# EAGLE board AniBike_v2.8_BT_MainBoard (EAGLE 5.08), part 1 of 2
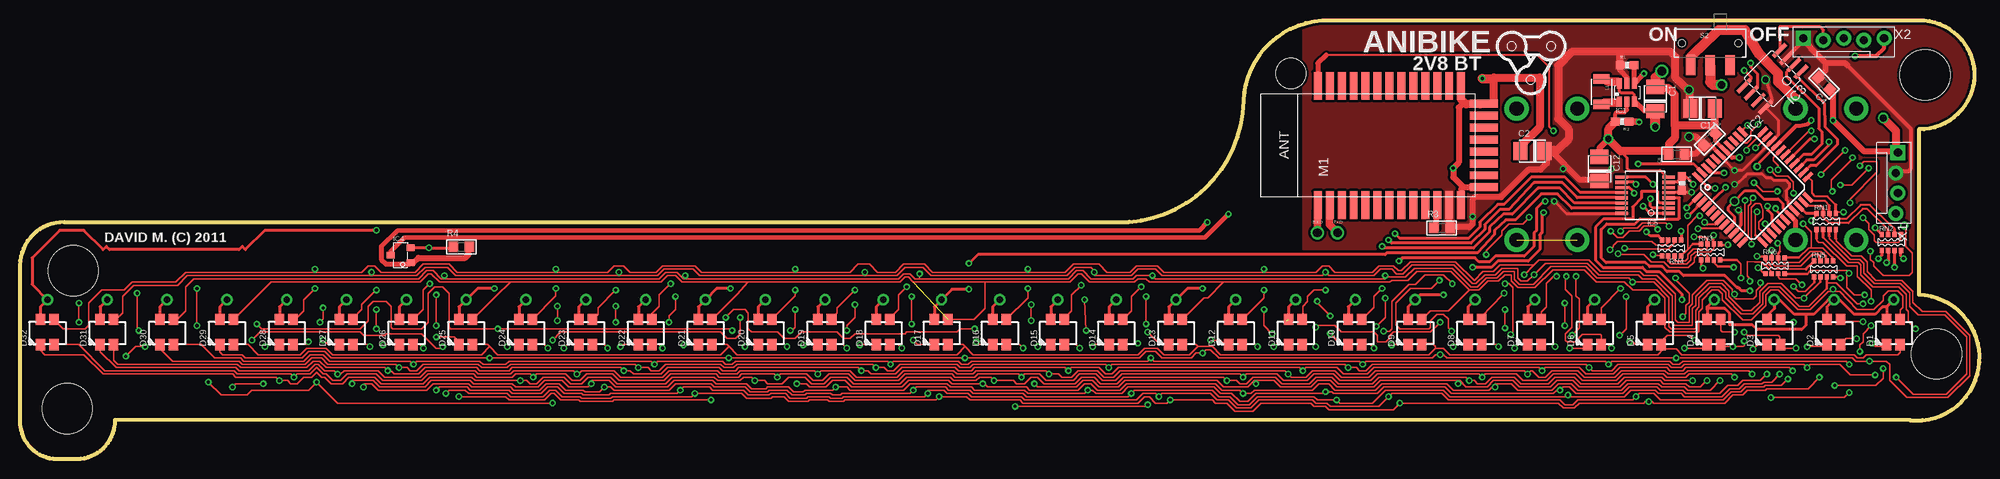
[diagram p5: board, top side]
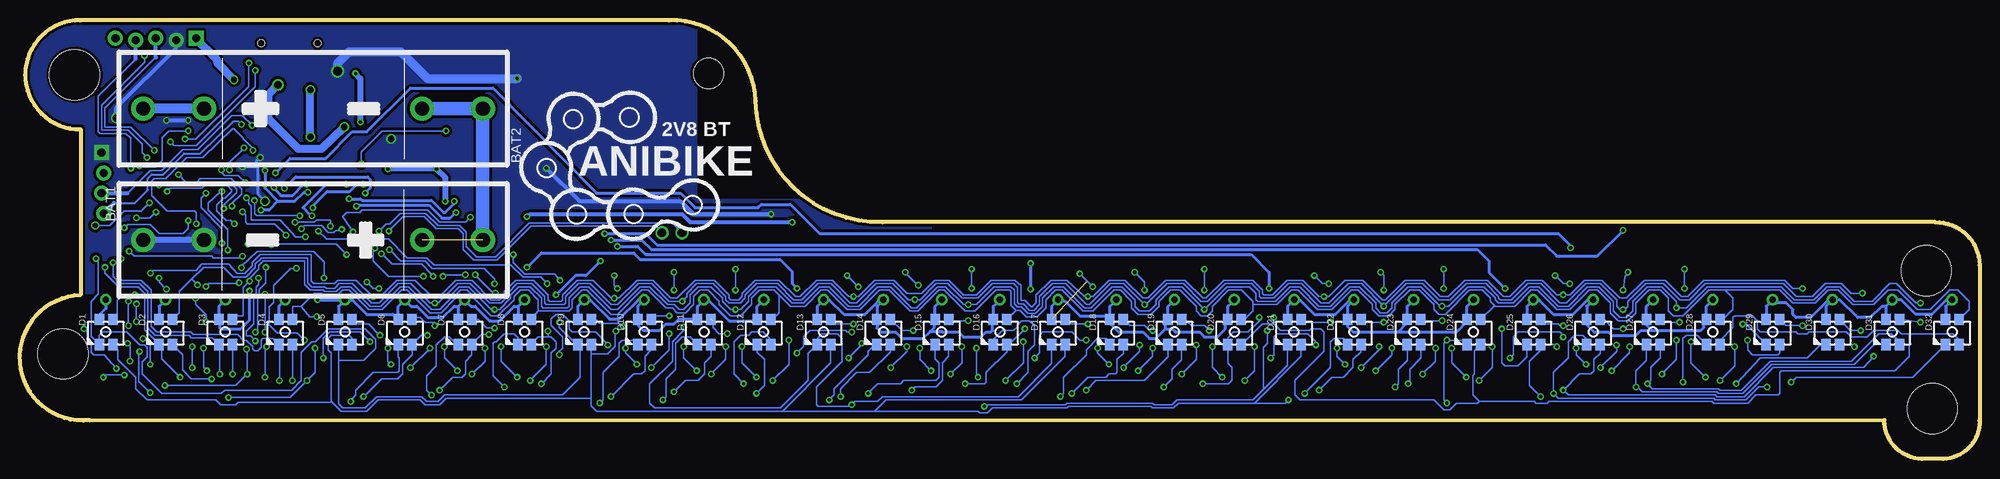
[diagram p6: board, bottom side, seen from below]

Size 246.3 x 55.17 mm. Coordinates in mm from the lower left corner, seen from the top.
Outline: 137.87,29.77 arc90 153.82,45.01 arc-90 164.69,55.17 238.66,55.17 arc-182 238.66,41.45 238.66,20.62 arc-184 237.54,4.88 11.96,4.91 arc-90 7.26,0 4.57,0 arc-90 0,4.83 0,24.38 arc-90 5.59,29.77 137.87,29.77
Copper layers (1*16): Top 0.035mm / dielectric 1.5mm / Bottom 0.035mm
Design rules "default *": minimum track width 7mil, minimum drill 15mil, track to track 7mil, track to pad 8mil, pad to pad 8mil, via to via 8mil, smd to smd 8mil, copper to edge 10mil, drill to drill 15mil, minimum pad ring 10mil, minimum via ring 8mil, stop-mask expansion 4mil, vias tented up to drill 32mil, thermal gap 10mil
Holes 6.35 mm at 240.89,13.21 239.42,48.31 6.71,23.67 5.94,6.35
Holes 3.81 mm at 159.74,48.49

## Footprints (pad centres in the part's own frame; a part is rotated, then mirrored left to right if it is on the bottom)
BATTERY_AAA = drill 1.778 pad 3.048 round: MINUS1 21.336,0; MINUS2 13.716,0; PLUS1 -21.336,0; PLUS2 -13.716,0
C3528-21/T = smd 1.778 x 2.286: + 1.524,0; - -1.524,0
C0805 = smd 1.2 x 1.3: 1 -1.016,0; 2 1.016,0
LED1210_DS_ISO = drill 0.8 pad 1.422 round: 1 0,4.064 | smd 1.2 x 1.4 bottom: BOT1 0.813,-1.575; BOT2 -0.889,-1.575; BOT3 -0.889,1.575; BOT4 0.813,1.575 | smd 1.2 x 1.4: TOP1 -0.889,-1.575; TOP2 0.813,-1.575; TOP3 0.813,1.575; TOP4 -0.889,1.575
DDC = smd 0.635 x 1.27: 1 -0.95,-1.15; 2 0,-1.15; 3 0.95,-1.15; 4 0.95,1.15; 5 0,1.15; 6 -0.95,1.15
TQFP44 = smd 1.5 x 0.5: 1 -5.8,4; 2 -5.8,3.2; 3 -5.8,2.4; 4 -5.8,1.6; 5 -5.8,0.8; 6 -5.8,0; 7 -5.8,-0.8; 8 -5.8,-1.6; 9 -5.8,-2.4; 10 -5.8,-3.2; 11 -5.8,-4; 23 5.8,-4; 24 5.8,-3.2; 25 5.8,-2.4; 26 5.8,-1.6; 27 5.8,-0.8; 28 5.8,0; 29 5.8,0.8; 30 5.8,1.6; 31 5.8,2.4; 32 5.8,3.2; 33 5.8,4 | smd 0.5 x 1.5: 12 -4,-5.8; 13 -3.2,-5.8; 14 -2.4,-5.8; 15 -1.6,-5.8; 16 -0.8,-5.8; 17 0,-5.8; 18 0.8,-5.8; 19 1.6,-5.8; 20 2.4,-5.8; 21 3.2,-5.8; 22 4,-5.8; 34 4,5.8; 35 3.2,5.8; 36 2.4,5.8; 37 1.6,5.8; 38 0.8,5.8; 39 0,5.8; 40 -0.8,5.8; 41 -1.6,5.8; 42 -2.4,5.8; 43 -3.2,5.8; 44 -4,5.8
SOIC8 = smd 0.5 x 2.2: 1 -1.905,-3.154; 2 -0.645,-3.154; 3 0.625,-3.154; 4 1.895,-3.154; 5 1.905,3.154; 6 0.635,3.154; 7 -0.635,3.154; 8 -1.905,3.154
HALL_SENSOR_SE = smd 1 x 0.8: 1 1.15,-1; 2 1.15,0.9; 3 -1.35,-0.05
TSSOP16 = smd 0.4 x 1.6: 1 -2.225,-2.85; 2 -1.575,-2.85; 3 -0.925,-2.85; 4 -0.275,-2.85; 5 0.375,-2.85; 6 1.025,-2.85; 7 1.675,-2.85; 8 2.325,-2.85; 9 2.325,3.05; 10 1.675,3.05; 11 1.025,3.05; 12 0.375,3.05; 13 -0.275,3.05; 14 -0.925,3.05; 15 -1.575,3.05; 16 -2.225,3.05
1210 = smd 1.2 x 2: 1 -1.6,0; 2 1.6,0
BTM400_6B = smd 3.5 x 1: 1 -7.4,7.66; 2 -7.4,6.16; 3 -7.4,4.66; 4 -7.4,3.16; 5 -7.4,1.66; 6 -7.4,0.16; 7 -7.4,-1.34; 8 -7.4,-2.84; 9 -7.4,-4.34; 10 -7.4,-5.84; 11 -7.4,-7.34; 12 -7.4,-8.84; 13 -7.4,-10.34; 22 7.6,-10.34; 23 7.6,-8.84; 24 7.6,-7.34; 25 7.6,-5.84; 26 7.6,-4.34; 27 7.6,-2.84; 28 7.6,-1.34; 29 7.6,0.16; 30 7.6,1.66; 31 7.6,3.16; 32 7.6,4.66; 33 7.6,6.16; 34 7.6,7.66 | smd 1 x 3.5: 14 -5.15,-13.2; 15 -3.65,-13.2; 16 -2.15,-13.2; 17 -0.65,-13.2; 18 0.85,-13.2; 19 2.35,-13.2; 20 3.85,-13.2; 21 5.35,-13.2
0603-RES = smd 1.1 x 1: 1 -0.85,0; 2 0.85,0
R0805 = smd 1.2 x 1.3: 1 -1.016,0; 2 1.016,0
YCTC164 = smd 0.559 x 0.6: P$1 -1.2,-1.003; P$2 -0.4,-1.003; P$3 0.4,-1.003; P$4 1.2,-1.003; P$5 1.2,1.003; P$6 0.4,1.003; P$7 -0.4,1.003; P$8 -1.2,1.003
SWITCH-SPDT-SMD = smd 1.2 x 2.5: 1 -2.5,-2.75; 2 0,-2.75; 3 2.5,-2.75 | hole 0.9: -3.55,0; 3.55,0
MOLEX-1X4_LOCK = drill 1.016 pad 1.88 square: 1 0,0.127 | drill 1.016 pad 1.88 round: 2 2.54,-0.127; 3 5.08,0.127; 4 7.62,-0.127
MOLEX-1X5_LOCK = drill 1.016 pad 1.88 square: 1 0,0.127 | drill 1.016 pad 1.88 round: 2 2.54,-0.127; 3 5.08,0.127; 4 7.62,-0.127; 5 10.16,0.127

## Placement (x,y rotation side)
BAT1  BATTERY_AAA  [BATTERY_AAA]  209.45,27.53 180 bottom
BAT2  BATTERY_AAA  [BATTERY_AAA]  209.45,44.04 0 bottom
C1  10uF  [C3528-21/T]  205.54,45.26 270 top
C2  10uF  [C3528-21/T]  190.09,38.71 0 top
C3  100nF  [C0805]  212.39,40.18 225 top
C4  100nF  [C0805]  226.75,47.22 135 top
C6  100nF  [C0805]  208.23,38.3 0 top
C11  47uF  [C3528-21/T]  211.48,44.09 180 top
C12  10uF  [C3528-21/T]  198.53,36.47 270 top
D1  LED_RGB_DS_ISO  [LED1210_DS_ISO]  235.51,15.95 0 top
D2  LED_RGB_DS_ISO  [LED1210_DS_ISO]  227.99,15.95 0 top
D3  LED_RGB_DS_ISO  [LED1210_DS_ISO]  220.47,15.95 0 top
D4  LED_RGB_DS_ISO  [LED1210_DS_ISO]  212.95,15.95 0 top
D5  LED_RGB_DS_ISO  [LED1210_DS_ISO]  205.44,15.95 0 top
D6  LED_RGB_DS_ISO  [LED1210_DS_ISO]  197.92,15.95 0 top
D7  LED_RGB_DS_ISO  [LED1210_DS_ISO]  190.4,15.95 0 top
D8  LED_RGB_DS_ISO  [LED1210_DS_ISO]  182.88,15.95 0 top
D9  LED_RGB_DS_ISO  [LED1210_DS_ISO]  175.36,15.95 0 top
D10  LED_RGB_DS_ISO  [LED1210_DS_ISO]  167.84,15.95 0 top
D11  LED_RGB_DS_ISO  [LED1210_DS_ISO]  160.32,15.95 0 top
D12  LED_RGB_DS_ISO  [LED1210_DS_ISO]  152.81,15.95 0 top
D13  LED_RGB_DS_ISO  [LED1210_DS_ISO]  145.29,15.95 0 top
D14  LED_RGB_DS_ISO  [LED1210_DS_ISO]  137.77,15.95 0 top
D15  LED_RGB_DS_ISO  [LED1210_DS_ISO]  130.45,15.95 0 top
D16  LED_RGB_DS_ISO  [LED1210_DS_ISO]  123.14,15.95 0 top
D17  LED_RGB_DS_ISO  [LED1210_DS_ISO]  115.82,15.95 0 top
D18  LED_RGB_DS_ISO  [LED1210_DS_ISO]  108.51,15.95 0 top
D19  LED_RGB_DS_ISO  [LED1210_DS_ISO]  101.19,15.95 0 top
D20  LED_RGB_DS_ISO  [LED1210_DS_ISO]  93.68,15.95 0 top
D21  LED_RGB_DS_ISO  [LED1210_DS_ISO]  86.16,15.95 0 top
D22  LED_RGB_DS_ISO  [LED1210_DS_ISO]  78.64,15.95 0 top
D23  LED_RGB_DS_ISO  [LED1210_DS_ISO]  71.12,15.95 0 top
D24  LED_RGB_DS_ISO  [LED1210_DS_ISO]  63.6,15.95 0 top
D25  LED_RGB_DS_ISO  [LED1210_DS_ISO]  56.08,15.95 0 top
D26  LED_RGB_DS_ISO  [LED1210_DS_ISO]  48.56,15.95 0 top
D27  LED_RGB_DS_ISO  [LED1210_DS_ISO]  41.05,15.95 0 top
D28  LED_RGB_DS_ISO  [LED1210_DS_ISO]  33.53,15.95 0 top
D29  LED_RGB_DS_ISO  [LED1210_DS_ISO]  26.01,15.95 0 top
D30  LED_RGB_DS_ISO  [LED1210_DS_ISO]  18.49,15.95 0 top
D31  LED_RGB_DS_ISO  [LED1210_DS_ISO]  10.97,15.95 0 top
D32  LED_RGB_DS_ISO  [LED1210_DS_ISO]  3.45,15.95 0 top
IC1  TI_TPS61073DDC  [DDC]  201.98,46.08 0 top
IC2  ATXMEGA_XX_D4TQFP44  [TQFP44]  217.78,34.19 45 top
IC3  AT26DF321  [SOIC8]  220.27,47.8 135 top
IC4  HALL_SENSORSMT  [HALL_SENSOR_SE]  47.96,25.65 0 top
IC5  SN74CB3Q3251TSSOP16  [TSSOP16]  204.37,33.12 90 top
L1  4.7 uH  [1210]  198.78,46.18 270 top
M1  BTM400_6BBTM400_6B  [BTM400_6B]  170.79,39.32 90 top
R1  [0603-RES]  201.98,49.53 0 top
R2  [0603-RES]  201.37,42.42 180 top
R3  10K  [R0805]  178.71,29.06 0 top
R4  10K  [R0805]  55.47,26.67 0 top
R5  47k  [0603-RES]  208.89,34.67 270 top
RN1  RESISTOR_ARR4  [YCTC164]  227.03,29.87 0 top
RN2  RESISTOR_ARR4  [YCTC164]  235.2,27.23 0 top
RN3  RESISTOR_ARR4  [YCTC164]  212.5,26.01 0 top
RN4  RESISTOR_ARR4  [YCTC164]  207.57,26.52 180 top
RN5  RESISTOR_ARR4  [YCTC164]  226.69,23.88 0 top
RN6  RESISTOR_ARR4  [YCTC164]  220.57,24.28 0 top
S2  [SWITCH-SPDT-SMD]  212.45,52.27 0 top
U$1  ANIBIKE_LOGOLOGO_3_MED  [ANIBIKE_LOGO_3_MEDIUM]  189.89,50.5 0 top
U$2  ANIBIKE_LOGOLOGO_6_BIG  [ANIBIKE_LOGO_6_BIG]  168.55,37.49 0 bottom
X1  PDI_INTERFACEHEADER0.1IN  [MOLEX-1X4_LOCK]  235.92,38.51 270 top
X2  ANIBIKE_SEC_INTERFACEHEADER0.1IN  [MOLEX-1X5_LOCK]  224.13,52.81 0 top

## Tracks (layer width: path | path; a pad name or v marks a point on that pad's centre or on a via)
+3.6V  (via drill 0.41, 0.7, 0.8)
  Top 0.203: 222.98,31.22 IC2.19 | 201.13,49.65 R1.1 | 179.63,31.41 M1.12
  Top 0.406: 222.98,31.22 222.2,32 222.2,32.41 222,32.61 222,33.73 222.4,34.14 222.4,34.65 222,35.05 220.37,35.05 220.07,35.36 219.46,35.36 218.95,35.86 217.12,35.86 216.71,35.46 215.85,34.65 215.75,34.54 v215.49,34.54 | v219.41,47.7 220.22,45.06 219.84,44.68 IC3.8 220.98,42.63 220.98,40.74 220.23,39.99 IC2.31 216.47,36.27 v215.49,36.27 214.38,37.39 214.38,37.59 IC2.39 | C12.+ v200.05,36.47 | v192.84,32.41 194.36,30.89 201.31,30.89 IC5.16 | 208.88,33.52 R5.2 | 208.88,33.52 208.89,33.53 207.25,33.53 IC5.5 | 208.88,33.52 209.27,33.53 v210.11,33.53 | v216,31.29 216.31,30.99 216.31,29.36 216.04,29.06 IC2.9
  Top 0.508: C3.2 212.5,39.46 IC2.39 | IC3.3 224.36,52.93 X2.1 | 229.72,49.48 237.64,41.55 237.64,36.47 237.34,36.17 235.99,36.17 X1.2
  Top 0.559: 45.42,26.72 47.45,28.75 148.23,28.75 v149.25,29.77
  Top 0.61: 45.42,26.72 45.42,25.1 46.02,24.49 48.94,24.49 IC4.1
  Top 0.635: R1.1 201.07,49.58 201.07,48.88 201.98,47.97 IC1.5
  Top 0.762: C3.2 210.57,38.35 209.25,38.35 209.19,38.3 C6.2 | R3.2 179.63,29.06 179.53,29.16 179.63,29.16 | 179.63,29.16 182.17,29.16 182.58,29.57 v182.58,30.48 182.58,32.61 182.88,32.92 186.13,32.92 189.59,36.37 191.11,36.37 191.92,37.19 191.92,38.81 | 179.63,29.16 179.63,31.41 | IC4.1 49.44,24.65 50.09,25.3 55.98,25.3 56.39,25.7 56.39,26.57 R4.2 | C12.+ 198.22,35.15 195.99,35.15 192.33,38.81 | 229.72,49.48 229.36,49.83 226.92,49.83 | 226.92,49.83 225.2,51.56 X2.1 | C4.2 226.92,48.83 226.92,49.83
  Top 0.889: C3.2 210.62,40.52 v209.8,40.49
  Top 0.914: 201.07,51.21 201.07,49.99 201.13,49.65
  Top 1.016: C2.+ 191.92,38.81 192.33,38.81 193.24,38.81 194.67,40.23 194.67,41.45 193.34,42.77 193.34,49.48 195.07,51.21 201.07,51.21 207.47,51.21 208.08,50.55 208.08,47.9 209.6,46.43 v209.8,46.43 209.8,44.3 210.01,44.15 C11.+
  Bottom 0.406: 224.28,52.93 X2.1 | v210.11,33.53 210.62,33.53 211.73,32.41 213.87,32.41 | 213.87,32.41 215.49,34.04 v215.49,34.54 v215.49,36.27 | 213.87,32.41 214.99,31.29 v216,31.29
  Bottom 0.508: v182.58,30.48 182.17,30.78 163.07,30.78 162.05,29.77 v149.25,29.77 | v200.05,36.47 v193.95,36.47
  Bottom 0.762: v193.95,36.47 192.84,35.36 v192.84,32.41
  Bottom 1.016: v209.8,40.49 v209.8,46.43 | v219.41,47.7 221.39,49.68 221.59,50.29 224.28,52.93
  pour Top (isolate 0.305, no thermals): 185.62,58.22 246.18,58.22 249.43,54.97 249.43,26.11 249.02,25.7 186.03,25.7 161.24,26.31 161.24,57.61
B1_BOT  (via drill 0.41)
  Top 0.203: v201.88,20.42 201.88,16.36 v201.07,15.54 | v171.6,20.22 171.6,17.78 v170.48,16.66 | v141.53,20.42 v141.53,16.97 | v112.06,20.42 v112.06,16.97 | v82.4,20.42 82.4,18.8 81.58,17.98 v81.58,17.17 | v52.32,20.62 v52.32,16.76 | v22.25,21.44 v22.25,16.76 | v231.85,20.62 230.53,20.62 229.62,21.54 229.62,22.99 v229.9,23.37 229.58,23.69 225.15,23.67 225.04,23.67 224.64,23.27 | 221.79,23.27 RN6.P$4
  Top 0.305: 224.64,23.27 221.79,23.27
  Bottom 0.203: v229.9,23.37 229.57,23.7 224.18,23.7 224.16,23.72 223.42,24.49 220.07,24.49 219,23.32 218.03,23.32 217.12,24.28 217.12,24.71 216.13,25.7 209.7,25.7 209.7,22.35 209.4,22.05 206.76,22.05 206.35,22.45 204.01,22.45 201.98,20.42 v201.88,20.42 200.96,20.42 198.93,22.45 196.6,22.45 194.56,20.42 193.55,20.42 191.52,22.45 189.48,22.45 187.05,20.02 186.03,20.02 185.42,20.62 185.42,21.03 184,22.45 181.76,22.45 179.93,20.62 179.93,20.02 179.73,19.81 178.31,19.81 178.1,20.02 178.1,20.62 176.28,22.45 174.24,22.45 172.01,20.22 v171.6,20.22 170.99,20.22 168.76,22.45 166.73,22.45 164.49,20.22 163.68,20.22 161.44,22.45 159,22.45 157.18,20.62 157.18,20.22 156.97,20.02 155.96,20.02 155.55,20.42 155.55,20.83 153.92,22.45 150.88,22.45 148.84,20.42 148.23,20.42 146.2,22.45 144.17,22.45 142.14,20.42 v141.53,20.42 140.92,20.42 138.89,22.45 136.45,22.45 134.82,20.83 132.99,20.83 131.37,22.45 129.54,22.45 127.71,20.62 126.09,20.62 124.26,22.45 121.21,22.45 120.5,21.84 120.5,19.91 119.99,19.91 119.18,19.1 119.08,19.1 118.57,19.61 118.57,20.62 116.74,22.45 114.71,22.45 112.47,20.42 v112.06,20.42 111.46,20.42 109.42,22.45 107.39,22.45 105.16,20.22 104.55,20.22 102.31,22.45 99.87,22.45 97.64,20.22 97.23,20.22 95,22.45 91.34,22.45 90.12,21.23 90.12,20.83 89.92,20.62 88.9,20.62 87.07,22.45 85.04,22.45 83.01,20.42 v82.4,20.42 81.79,20.42 79.76,22.45 77.52,22.45 75.08,20.02 74.68,20.02 72.24,22.45 69.8,22.45 67.77,20.42 66.75,20.42 64.72,22.45 61.87,22.45 59.84,20.42 59.03,20.42 57,22.45 54.97,22.45 53.14,20.62 v52.32,20.62 51.51,20.62 49.68,22.45 47.45,22.45 45.21,20.22 44.4,20.22 42.16,22.45 39.52,22.45 37.49,20.42 36.68,20.42 34.65,22.45 24.49,22.45 23.47,21.44 v22.25,21.44
  Bottom 0.203: v201.07,15.54 202.49,16.97 203.99,16.97 D5.BOT3 | v170.48,16.66 170.99,17.07 173.43,17.07 174.04,17.68 174.24,17.68 174.12,17.48 D9.BOT3 | v141.53,16.97 143.84,16.97 D13.BOT3 | v112.06,16.97 114.38,16.97 D17.BOT3 | v81.58,17.17 84.91,17.17 D21.BOT3 | v52.32,16.76 52.73,16.76 52.93,16.97 54.64,16.97 D25.BOT3 | v22.25,16.76 24.36,16.76 D29.BOT3 | v231.85,20.62 233.38,20.62 234.09,19.91 234.09,18.06 D1.BOT3
B1_TOP  (via drill 0.41)  (1 unrouted)
  Top 0.203: D1.TOP3 236.32,18.75 236.63,19.05 236.63,20.52 236.02,21.13 234.8,21.13 234.19,20.52 234.19,19.91 232.97,18.8 230.84,18.8 228.7,21.03 227.89,21.03 | 227.89,21.03 227.28,21.03 225.04,18.8 223.42,18.8 220.98,21.23 220.07,21.23 219.46,20.62 219.46,19.3 217.63,17.48 216.51,17.48 213.97,20.02 213.97,20.73 213.46,21.23 212.65,21.23 211.43,20.02 211.43,18.9 211.02,18.49 211.02,15.95 207.37,15.95 206.76,16.56 206.76,17.37 | 91.54,22.25 110.64,22.25 111.25,22.86 111.66,22.86 112.27,22.25 131.98,22.25 132.99,23.27 133.4,23.27 134.42,22.25 140.11,22.25 140.51,22.66 141.53,22.66 141.94,22.25 151.28,22.25 | 91.54,22.25 83.21,22.25 82.4,23.06 81.38,23.06 80.57,22.25 61.67,22.25 | 61.67,22.25 52.73,22.25 51.71,23.27 51.31,23.27 50.29,22.25 31.6,22.25 26.87,17.53 D29.TOP3 | D13.TOP3 148.84,20.27 149.3,20.27 151.28,22.25 | 121.41,22.25 121.31,22.25 121.31,18.9 119.94,17.53 D17.TOP3 | D21.TOP3 90.12,20.68 91.54,22.25 | D25.TOP3 59.84,20.47 61.67,22.25 | D9.TOP3 177.24,18.59 179.53,18.59 182.17,21.23 | 206.76,17.37 206.4,17.37 D5.TOP3 | 206.76,17.37 206.76,20.22 205.74,21.23 202.69,21.23 201.68,22.25 198.12,22.25 196.6,23.77 192.63,23.77 190.4,21.54 188.26,21.54 187.45,22.35 187.45,23.16 186.64,23.16 185.83,22.35 184.51,22.35 183.39,21.23 182.17,21.23 | 182.17,21.23 179.83,23.57 175.56,23.57 174.45,22.45 172.42,22.45 172.21,22.25 151.28,22.25 | v228.8,22.76 228.69,22.87 | 227.89,21.03 v227.89,21.34
  Top 0.305: 228.69,22.87 RN5.P$4
  Bottom 0.203: v228.8,22.76 228.8,22.25 v227.89,21.34
B2_BOT  (via drill 0.41)
  Top 0.203: v194.16,19.61 v194.16,16.76 | v163.07,19.81 163.07,19.61 v164.69,17.98 | v133.81,20.02 v134.01,16.15 | v104.95,19.41 104.95,17.78 103.94,16.76 v103.94,16.15 | v74.88,19.2 v74.88,17.17 | v44.81,18.8 v44.81,16.36 | v14.73,20.83 14.73,16.36 v14.94,16.15 | RN6.P$3 220.97,22.87 221.18,22.66 223.22,22.66 v223.98,21.89
  Bottom 0.203: D2.BOT3 227.08,17.58 226.26,18.39 226.26,21.03 224.69,22.61 | 224.69,22.61 223.22,24.08 220.68,24.08 219.51,22.91 217.88,22.91 216.71,24.08 216.71,24.51 215.93,25.3 210.11,25.3 210.11,22.15 209.6,21.64 207.98,21.64 207.77,21.44 206.76,21.44 206.15,22.05 204.52,22.05 202.08,19.61 201.17,19.61 198.73,22.05 197.21,22.05 194.77,19.61 v194.16,19.61 193.75,19.61 191.31,22.05 189.69,22.05 187.25,19.61 185.83,19.61 185.01,20.42 185.01,20.83 183.79,22.05 181.97,22.05 180.34,20.42 180.34,19.61 180.14,19.41 177.9,19.41 177.7,19.61 177.7,20.42 176.07,22.05 174.65,22.05 172.01,19.41 171.2,19.41 168.55,22.05 166.93,22.05 164.69,19.81 v163.07,19.81 162.46,20.42 162.46,20.83 161.24,22.05 159.21,22.05 157.58,20.42 157.58,20.02 157.18,19.61 155.75,19.61 155.14,20.22 155.14,20.62 153.72,22.05 151.08,22.05 149.05,20.02 148.03,20.02 146,22.05 144.37,22.05 141.94,19.61 141.12,19.61 138.68,22.05 136.65,22.05 134.62,20.02 v133.81,20.02 133.2,20.02 131.17,22.05 129.74,22.05 127.91,20.22 125.88,20.22 124.05,22.05 121.41,22.05 120.9,21.54 120.9,19.71 120.7,19.51 120.19,19.51 119.38,18.69 118.87,18.69 118.16,19.41 118.16,20.42 116.54,22.05 114.91,22.05 112.27,19.41 111.86,19.41 109.22,22.05 107.59,22.05 v104.95,19.41 104.75,19.41 102.11,22.05 100.08,22.05 97.84,19.81 97.03,19.81 94.79,22.05 91.54,22.05 90.53,21.03 90.53,20.42 90.32,20.22 88.7,20.22 86.87,22.05 85.24,22.05 82.8,19.61 81.79,19.61 79.35,22.05 77.72,22.05 v74.88,19.2 74.68,19.2 74.68,19.41 72.03,22.05 70,22.05 67.97,20.02 66.55,20.02 64.52,22.05 62.08,22.05 60.45,20.42 60.45,20.22 60.25,20.02 58.83,20.02 56.79,22.05 55.17,22.05 52.73,19.61 51.92,19.61 49.48,22.05 47.65,22.05 45.62,20.02 45.62,19.2 45.21,18.8 v44.81,18.8 44.6,18.8 44.2,19.2 44.2,19.81 41.96,22.05 39.73,22.05 37.69,20.02 36.47,20.02 34.44,22.05 24.69,22.05 23.06,20.42 21.03,20.42 19.41,22.05 17.37,22.05 16.15,20.83 v14.73,20.83
  Bottom 0.203: v164.69,17.98 166.52,17.98 D10.BOT3 | v134.01,16.15 135.41,16.15 D14.BOT3 | v103.94,16.15 104.34,16.15 104.95,16.76 106.78,16.76 106.98,16.97 D18.BOT3 | v74.88,17.17 76.91,17.17 77.32,17.37 D22.BOT3 | v44.81,16.36 46.02,16.36 47.24,17.58 D26.BOT3 | v14.94,16.15 16.23,16.15 D30.BOT3 | D6.BOT3 196.77,17.78 195.99,17.78 195.38,17.17 194.16,17.17 v194.16,16.76 | 224.69,22.61 v223.98,21.89
B2_TOP  (via drill 0.41)
  Top 0.203: D2.TOP3 229.06,17.27 v231.65,17.27 | v231.65,19.51 230.94,19.51 228.3,22.15 227.08,22.15 227.1,22.13 | 227.08,21.44 224.84,19.2 223.62,19.2 221.18,21.64 219.86,21.64 219.05,20.83 219.05,19.51 217.78,18.24 216.36,18.24 214.38,20.22 214.38,20.93 213.66,21.64 212.45,21.64 211.02,20.22 211.02,19.1 210.62,18.69 210.62,16.36 207.57,16.36 207.26,16.66 207.26,20.32 205.33,22.25 v202.69,22.25 202.18,22.76 198.22,22.76 196.8,24.18 192.43,24.18 190.2,21.95 188.47,21.95 187.86,22.56 187.86,23.57 186.44,23.57 185.62,22.76 184.3,22.76 183.18,21.64 182.37,21.64 180.04,23.98 175.26,23.98 174.14,22.86 171.81,22.86 v171.6,23.06 171.6,22.66 142.75,22.66 v142.34,23.06 140.31,23.06 139.9,22.66 134.62,22.66 133.6,23.67 132.79,23.67 131.78,22.66 113.08,22.66 | v201.17,21.44 198.73,19 D6.TOP3 | 113.08,22.66 112.47,22.66 111.86,23.27 111.05,23.27 110.44,22.66 83.62,22.66 | 83.62,22.66 83.41,22.66 82.6,23.47 81.18,23.47 80.37,22.66 53.34,22.66 | 53.34,22.66 52.93,22.66 51.92,23.67 51.1,23.67 50.09,22.66 21.84,22.66 20.83,21.64 20.83,18.59 19.76,17.53 D30.TOP3 | D10.TOP3 170.18,19.05 170.18,20.42 v171.2,21.44 | v140.92,21.64 139.7,20.42 139.7,18.59 138.63,17.53 D14.TOP3 | 113.08,22.66 v113.08,23.27 | v111.46,21.64 110.44,20.62 110.44,18.8 109.32,17.68 D18.TOP3 | 83.62,22.66 v83.62,23.06 | v81.79,22.05 80.37,20.62 80.37,19.2 79.45,18.29 D22.TOP3 | 53.34,22.66 v53.34,23.06 | v51.51,22.05 50.7,21.23 50.7,18.8 49.43,17.53 D26.TOP3
  Top 0.305: 227.08,22.15 227.08,21.44 | RN5.P$3 227.1,22.13
  Bottom 0.203: v231.65,19.51 v231.65,17.27 | v202.69,22.25 201.88,21.44 v201.17,21.44 | v171.2,21.44 171.6,21.84 v171.6,23.06 | v142.34,23.06 v140.92,21.64 | v113.08,23.27 v111.46,21.64 | v83.62,23.06 82.6,22.05 v81.79,22.05 | v53.34,23.06 52.32,22.05 v51.51,22.05
B3_BOT  (via drill 0.41)  (1 unrouted)
  Top 0.178: RN6.P$2 220.17,23.46 220.07,23.57 220.07,23.65 219.41,24.31 219.33,24.31 218.85,24.79 218.01,24.79
  Top 0.203: v186.64,18.8 v186.64,16.46 | v156.36,18.8 156.36,16.76 v157.38,15.75 | v127.1,19.41 v127.1,17.37 | v97.43,18.8 97.43,16.56 97.03,16.15 v96.82,16.15 | v67.56,19.2 v67.56,17.37 | v38.1,19 38.1,17.58 v37.69,17.17 | v7.42,19.61 v7.42,17.17 | 218.01,24.79 217.12,24.82 217.12,23.01 217.42,22.71 v217.42,22.35
  Bottom 0.203: D3.BOT3 219.15,17.98 218.24,17.98 218.24,21.51 | v186.64,16.46 187.66,16.46 188.72,17.53 D7.BOT3 | v127.1,17.37 129.13,17.37 129.18,17.53 D15.BOT3 | v96.82,16.15 97.43,16.76 99.06,16.76 99.92,17.53 D19.BOT3 | v67.56,17.37 69.77,17.37 D23.BOT3 | v37.69,17.17 39.7,17.17 D27.BOT3 | v7.42,19.61 8.03,19.61 10.46,22.05 11.28,22.05 13.51,19.81 15.75,19.81 17.58,21.64 19.2,21.64 20.83,20.02 23.27,20.02 24.89,21.64 34.24,21.64 36.88,19 v38.1,19 38.1,19.81 39.93,21.64 41.76,21.64 43.59,19.81 43.59,18.59 44.4,17.78 45.21,17.78 46.02,18.59 46.02,19.81 47.85,21.64 49.28,21.64 51.71,19.2 52.93,19.2 55.37,21.64 56.59,21.64 58.62,19.61 60.45,19.61 60.86,20.02 60.86,20.22 62.28,21.64 64.31,21.64 66.75,19.2 v67.56,19.2 67.77,19.2 70.21,21.64 71.83,21.64 73.86,19.61 73.86,19 74.47,18.39 75.29,18.39 75.9,19 75.9,19.61 77.93,21.64 79.15,21.64 81.58,19.2 83.01,19.2 85.45,21.64 86.66,21.64 88.49,19.81 90.73,19.81 90.93,20.02 90.93,20.83 91.74,21.64 94.59,21.64 v97.43,18.8 100.28,21.64 101.9,21.64 103.53,20.02 103.53,19.41 104.34,18.59 105.56,18.59 106.17,19.2 106.17,20.02 107.8,21.64 109.02,21.64 111.66,19 112.47,19 115.11,21.64 116.33,21.64 117.75,20.22 117.75,19.2 118.67,18.29 119.58,18.29 120.4,19.1 120.9,19.1 121.31,19.51 121.31,21.23 121.72,21.64 123.85,21.64 126.09,19.41 v127.1,19.41 127.71,19.41 129.95,21.64 130.96,21.64 133.6,19 134.21,19 136.86,21.64 138.48,21.64 140.92,19.2 142.14,19.2 144.58,21.64 145.8,21.64 147.83,19.61 149.25,19.61 151.28,21.64 153.52,21.64 154.74,20.42 154.74,19.81 155.75,18.8 v156.36,18.8 156.97,18.8 157.99,19.81 157.99,20.22 159.41,21.64 161.04,21.64 162.05,20.62 162.05,19.61 162.86,18.8 163.47,18.8 164.08,19.41 164.9,19.41 167.13,21.64 168.35,21.64 171.2,18.8 172.01,18.8 174.85,21.64 175.87,21.64 177.29,20.22 177.29,19.2 177.5,19 180.54,19 180.75,19.2 180.75,20.22 182.17,21.64 183.59,21.64 184.61,20.62 184.61,20.22 186.03,18.8 v186.64,18.8 187.05,18.8 189.89,21.64 191.11,21.64 191.92,20.83 191.92,20.42 193.55,18.8 194.56,18.8 197.41,21.64 198.53,21.64 200.96,19.2 202.29,19.2 204.72,21.64 205.94,21.64 206.55,21.03 207.98,21.03 208.18,21.23 209.8,21.23 210.52,21.95 210.52,24.89 215.72,24.89 216.26,24.36 216.26,23.88 217.42,22.71 v217.42,22.35 218.24,21.54 218.24,21.51
  Bottom 0.203: v7.42,17.17 10.03,17.58 D31.BOT3 | 159.05,17.53 159.21,17.37 159.21,16.56 158.39,15.75 v157.38,15.75 | 218.24,21.51 218.21,21.54
B3_TOP  (via drill 0.41)
  Top 0.203: D3.TOP3 221.64,17.17 v222.91,17.17 | v193.14,22.96 192.74,22.96 191.82,22.05 191.82,19.1 191.21,18.49 D7.TOP3 | 106.17,23.06 110.24,23.06 111.25,24.08 113.49,24.08 114.5,23.06 131.57,23.06 132.59,24.08 134.62,24.08 135.03,23.67 v135.03,23.47 135.03,23.06 139.7,23.06 140.51,23.88 142.75,23.88 143.56,23.06 163.68,23.06 v164.08,23.47 164.49,23.06 170.18,23.06 170.99,23.88 172.42,23.88 173.02,23.27 173.84,23.27 174.96,24.38 180.24,24.38 182.58,22.05 182.98,22.05 184.1,23.16 185.42,23.16 186.23,23.98 188.26,23.98 188.26,22.76 188.67,22.35 189.48,22.35 v190.3,23.16 191.72,24.59 197,24.59 198.42,23.16 203.4,23.16 203.91,22.66 205.54,22.66 207.67,20.52 207.67,17.07 207.98,16.76 210.21,16.76 210.21,18.9 210.62,19.3 210.62,20.42 212.24,22.05 213.87,22.05 214.78,21.13 214.78,20.42 216.51,18.69 217.63,18.69 218.64,19.71 218.64,21.03 219.66,22.05 221.39,22.05 223.22,20.22 v224.23,20.22 226.3,22.28 | 106.17,23.06 85.45,23.06 84.63,23.88 80.98,23.88 80.16,23.06 75.29,23.06 | 75.29,23.06 54.76,23.06 53.75,24.08 50.9,24.08 49.89,23.06 44.2,23.06 | 44.2,23.06 21.03,23.06 19.81,21.84 14.33,21.84 12.9,20.42 12.9,18.39 12.04,17.53 D31.TOP3 | v164.08,21.23 162.66,21.23 161.85,20.42 161.85,19.81 161.24,19.2 161.24,17.98 161.14,17.88 D11.TOP3 | v133.4,21.84 132.18,20.62 132.18,18.59 131.27,17.68 D15.TOP3 | 106.17,23.06 v106.17,23.47 | v104.95,21.23 102.72,19 102.72,18.39 102.01,17.68 D19.TOP3 | 75.29,23.06 v75.29,23.47 | v74.88,21.23 72.64,19 72.64,18.19 71.93,17.48 D23.TOP3 | 44.2,23.06 v44.2,23.47 | v44.81,21.23 42.98,19.41 42.98,18.8 41.86,17.68 D27.TOP3
  Top 0.305: RN5.P$2 226.3,22.28
  Bottom 0.203: v222.91,17.17 222.91,18.08 224.23,19.41 v224.23,20.22 | v190.3,23.16 192.94,23.16 v193.14,22.96 | v164.08,23.47 v164.08,21.23 | v135.03,23.47 v133.4,21.84 | v106.17,23.47 104.95,22.25 v104.95,21.23 | v75.29,23.47 74.88,23.06 v74.88,21.23 | v44.2,23.47 44.6,22.86 v44.81,21.23
B4_BOT  (via drill 0.41)
  Top 0.203: RN6.P$1 219.24,23.28 | v208.08,22.76 208.08,22.56 209.8,20.83 209.8,19.71 209.4,19.3 209.4,18.29 v208.99,17.88
  Top 0.305: 219.24,23.28 v218.47,24.05
  Bottom 0.203: D4.BOT3 212.04,17.58 212.04,19.2 210.92,19.2 | 181.15,18.59 181.99,17.55 D8.BOT3 | 181.15,18.59 181.15,20.02 182.37,21.23 183.39,21.23 184.2,20.42 184.2,20.02 186.23,17.98 187.05,17.98 189.28,20.22 189.28,20.42 190.09,21.23 190.91,21.23 191.52,20.62 191.52,20.22 193.34,18.39 194.77,18.39 197.61,21.23 198.32,21.23 200.76,18.8 202.49,18.8 204.93,21.23 205.74,21.23 206.35,20.62 208.18,20.62 208.38,20.83 209.3,20.83 210.92,19.2 | 181.15,18.59 177.29,18.59 176.89,19 176.89,20.02 175.67,21.23 175.06,21.23 172.01,18.19 171.2,18.19 168.15,21.23 167.34,21.23 165.1,19 164.29,19 163.68,18.39 162.66,18.39 161.65,19.41 161.65,20.42 160.83,21.23 159.82,21.23 158.39,19.81 158.39,19.41 156.97,17.98 155.75,17.98 154.33,19.41 154.33,20.22 153.31,21.23 151.49,21.23 150.88,20.62 | 150.88,20.62 150.88,18.39 151.74,17.53 D12.BOT3 | 150.88,20.62 149.45,19.2 147.62,19.2 145.59,21.23 144.78,21.23 142.34,18.8 140.72,18.8 138.28,21.23 137.06,21.23 134.42,18.59 133.4,18.59 130.76,21.23 130.15,21.23 127.51,18.59 126.29,18.59 123.65,21.23 121.92,21.23 121.72,21.03 121.72,19.33 121.08,18.69 | 122.25,17.55 D16.BOT3 121.08,18.69 | D20.BOT3 92.41,17.53 91.34,18.59 91.34,19.41 | 91.34,19.41 88.29,19.41 86.46,21.23 85.65,21.23 83.21,18.8 81.38,18.8 78.94,21.23 78.13,21.23 76.3,19.41 76.3,18.8 75.49,17.98 74.27,17.98 73.46,18.8 73.46,19.41 71.63,21.23 70.41,21.23 68.58,19.41 68.58,18.8 67.97,18.19 67.16,18.19 64.11,21.23 62.48,21.23 61.47,20.22 61.47,19.81 60.86,19.2 | 62.53,17.53 D24.BOT3 61.04,19.2 60.86,19.2 | 60.86,19.2 58.42,19.2 56.39,21.23 55.58,21.23 53.14,18.8 51.51,18.8 49.07,21.23 48.06,21.23 46.43,19.61 46.43,18.39 45.42,17.37 44.2,17.37 43.18,18.39 43.18,19.61 41.55,21.23 40.13,21.23 39.12,20.22 39.12,18.59 38.51,17.98 37.29,17.98 34.04,21.23 32,21.23
  Bottom 0.203: 32,21.23 30.99,20.22 30.99,18.8 32.26,17.53 D28.BOT3 | 32,21.23 25.1,21.23 23.47,19.61 20.62,19.61 19,21.23 17.78,21.23 15.95,19.41 13.31,19.41 11.48,21.23 10.26,21.23 7.82,18.8 6.2,18.8 3.76,21.23 2.74,21.23 1.32,19.81 1.32,18.8 2.57,17.55 D32.BOT3 | 91.34,19.41 91.34,19.81 92.76,21.23 94.39,21.23 96.42,19.2 96.42,18.59 97.03,17.98 97.84,17.98 98.45,18.59 98.45,19.2 100.48,21.23 101.7,21.23 103.12,19.81 103.12,19.2 104.14,18.19 105.77,18.19 106.58,19 106.58,19.81 108,21.23 108.81,21.23 111.46,18.59 112.67,18.59 115.32,21.23 116.13,21.23 117.35,20.02 117.35,19 118.47,17.88 119.79,17.88 120.6,18.69 121.08,18.69 | v208.08,22.76 208.08,24.79 209.4,26.11 216.48,26.11 218.47,24.23 v218.47,24.05 | v208.99,17.88 209.91,17.88 210.92,19.2
B4_TOP  (via drill 0.41)
  Top 0.203: v215.49,15.95 213.97,15.95 213.77,16.15 D4.TOP3 | 190.3,24.38 190.91,24.99 197.21,24.99 198.63,23.57 203.61,23.57 204.11,23.06 205.74,23.06 208.08,20.73 208.08,17.48 208.38,17.17 209.8,17.17 209.8,19.1 210.21,19.51 210.21,20.62 212.04,22.45 214.07,22.45 215.19,21.34 215.19,21.03 v215.49,20.73 215.49,20.32 215.7,20.12 217.83,20.12 218.24,20.52 218.24,21.18 218.74,21.69 v218.74,22.15 | v186.54,20.83 186.33,20.62 183.69,17.88 D8.TOP3 | 190.3,24.38 v189.08,23.16 | 190.3,24.38 186.03,24.38 185.22,23.57 183.9,23.57 182.78,22.45 180.44,24.79 174.75,24.79 173.63,23.67 173.23,23.67 172.62,24.28 170.79,24.28 169.98,23.47 165.3,23.47 164.49,24.28 163.68,24.28 162.86,23.47 156.36,23.47 | 156.36,23.47 143.76,23.47 142.95,24.28 140.31,24.28 139.5,23.47 136.65,23.47 135.64,24.49 132.38,24.49 131.37,23.47 126.7,23.47 | 126.7,23.47 114.71,23.47 113.69,24.49 111.05,24.49 110.03,23.47 107.8,23.47 106.78,24.49 105.36,24.49 104.34,23.47 97.43,23.47 | 97.43,23.47 85.65,23.47 84.84,24.28 80.77,24.28 79.96,23.47 76.71,23.47 75.9,24.28 74.68,24.28 73.86,23.47 67.36,23.47 | 67.36,23.47 54.97,23.47 53.95,24.49 50.7,24.49 49.68,23.47 45.42,23.47 44.6,24.28 43.79,24.28 42.98,23.47 37.08,23.47 | 37.08,23.47 20.83,23.47 19.61,22.25 14.12,22.25 13.11,21.23 10.26,21.23 8.64,19.61 8.64,16.76 8.23,16.36 5.44,16.36 D32.TOP3 | 37.08,23.47 v37.08,23.88 | v37.08,21.44 35.66,20.02 35.66,18.59 34.59,17.53 D28.TOP3 | D24.TOP3 67.36,20.47 v67.36,21.44 | 67.36,23.47 v67.36,23.88 | D20.TOP3 97.43,20.47 v97.43,21.23 | 97.43,23.47 v97.43,23.88 | D16.TOP3 126.7,20.27 v126.7,21.44
  Top 0.203: 126.7,23.47 v126.7,23.88 | D12.TOP3 156.36,20.27 v156.36,21.23 | 156.36,23.47 v156.36,23.88 | RN5.P$1 225.38,22.86 225.35,22.86 | v222.91,21.69 223.52,21.08 224.38,21.08 225.5,22.19
  Top 0.305: RN5.P$1 225.5,22.19
  Bottom 0.203: v215.49,20.73 v215.49,15.95 | v189.08,23.16 186.74,20.83 v186.54,20.83 | v37.08,23.88 v37.08,21.44 | v67.36,23.88 v67.36,21.44 | v97.43,23.88 v97.43,21.23 | v126.7,23.88 v126.7,21.44 | v156.36,23.88 v156.36,21.23 | v218.74,22.15 218.85,22.05 222.55,22.05 v222.91,21.69
BT_KEY(NEW)  (via drill 0.41)
  Top 0.254: v192.74,41.25 192.23,41.76 192.23,49.28 190.7,50.8 164.19,50.8
  Top 0.356: v203.4,37.08 210.36,37.08 IC2.43
  Top 0.61: 164.19,50.8 163.13,49.74 M1.34
  Bottom 0.203: v203.4,37.08 203.4,38.61 200.76,41.25 v192.74,41.25
CS
  Top 0.406: IC3.1 223.52,48.31 223.52,47.96 226.82,44.65 226.87,41.76 228.4,40.23 228.4,39.52 225.76,36.88 225.04,36.88 224.19,36.03 IC2.24
G1_BOT  (via drill 0.41)
  Top 0.203: v29.16,14.94 30.18,15.95 42.77,15.95 43.18,15.54 45.82,15.54 46.02,15.75 50.5,15.75 52.32,13.92 52.93,13.92 v53.14,14.12 | v55.17,7.82 61.06,7.82 61.47,7.42 65.94,7.42 66.75,8.23 67.16,8.23 67.97,7.42 70.21,7.42 70.41,7.21 74.47,7.21 74.68,7.42 v86.87,7.42 | 208.79,27.54 RN4.P$1 | v180.04,22.05 178.92,23.16 176.58,23.16 175.36,21.95 174.55,21.95 172.42,19.81 172.42,16.36 172.11,16.05 v171.4,16.05
  Top 0.356: v208.79,28.65 208.79,27.54
  Bottom 0.203: D1.BOT2 233.98,13.74 233.98,12.5 231.75,10.26 231.75,8.84 230.33,7.42 221.69,7.42 221.08,6.81 219.15,6.81 218.85,7.11 207.21,7.11 207.16,7.21 | 207.16,7.21 207.16,13.31 207.57,13.72 207.57,15.14 207.16,15.54 204.93,15.54 204.55,15.16 D5.BOT2 | 174.52,7.62 174.48,13.21 | 174.48,13.21 D9.BOT2 | 174.52,7.62 192.74,7.62 193.55,6.81 195.38,6.81 195.99,7.42 201.27,7.42 202.69,5.99 205.94,5.99 207.16,7.21 | 174.52,7.62 174.52,6.68 173.84,5.99 150.47,5.99 | 150.47,5.99 144.4,12.07 D13.BOT2 | 150.47,5.99 138.89,5.99 | 138.89,5.99 137.46,7.42 120.4,7.42 114.94,12.88 D17.BOT2 | 138.89,5.99 125.88,5.99 125.68,5.79 124.66,5.79 124.05,6.4 114.71,6.4 114.5,6.6 104.14,6.6 103.94,6.4 101.3,6.4 100.69,7.01 91.14,7.01 | 91.14,7.01 85.27,12.88 D21.BOT2 | D29.BOT2 25.1,14.12 25.1,13.31 25.3,13.11 28.55,13.11 29.16,13.72 v29.16,14.94 | v53.14,14.12 53.39,14.38 D25.BOT2 55.17,13.72 56.59,12.29 56.59,9.25 v55.17,7.82 | v86.87,7.42 87.27,7.01 91.14,7.01 | v208.79,28.65 207.77,27.64 199.95,27.64 197.61,25.3 195.17,25.3 194.26,24.38 184.61,24.38 183.08,22.86 180.85,22.86 v180.04,22.05 | v171.4,16.05 171.5,15.95 171.5,14.12 172.41,13.21 174.48,13.21
G1_TOP  (via drill 0.41)
  Top 0.203: D1.TOP2 236.32,13.41 236.02,13.11 232.05,13.11 231.65,12.7 230.94,12.7 230.53,13.11 208.89,13.11 208.18,13.82 206.55,13.82 | 206.55,13.82 205.84,13.11 179.73,13.11 178.92,13.92 177.9,13.92 | 177.9,13.92 177.09,13.11 150.88,13.11 149.86,14.12 148.03,14.12 | 148.03,14.12 147.02,13.11 143.76,13.11 142.95,13.92 141.33,13.92 140.51,13.11 119.79,13.11 118.77,14.12 | 118.77,14.12 117.75,13.11 90.12,13.11 89.1,14.12 | 89.1,14.12 88.09,13.11 60.05,13.11 59.03,14.12 | 59.03,14.12 58.01,13.11 39.32,13.11 38.51,13.92 36.07,13.92 35.26,13.11 29.97,13.11 28.7,14.38 D29.TOP2 | 206.55,13.82 206.4,13.97 D5.TOP2 | 148.03,14.12 147.78,14.38 D13.TOP2 | 118.77,14.12 118.52,14.38 D17.TOP2 | 89.1,14.12 88.85,14.38 D21.TOP2 | 59.03,14.12 58.78,14.38 D25.TOP2 | D9.TOP2 176.33,14.53 177.5,14.53 177.9,14.12 177.9,13.92 | 206.55,13.82 206.55,15.04 207.06,15.54 209.91,15.54 v210.52,14.94 | 211.33,24.97 RN3.P$1 | v211.53,23.98 211.53,24.08
  Top 0.305: 211.33,24.97 211.33,24.28 211.53,24.08
  Bottom 0.203: v211.53,23.98 212.24,23.98 214.38,21.84 214.38,19.71 214.99,19.1 214.99,16.87 213.97,15.85 211.43,15.85 v210.52,14.94
G2_BOT  (via drill 0.41)
  Top 0.203: v222.2,10.06 221.39,9.25 219.35,9.25 219.15,9.04 216.92,9.04 216.31,8.43 215.09,8.43 214.07,7.42 206.15,7.42 205.33,8.23 203.5,8.23 v203.1,7.82 202.69,7.42 195.78,7.42 195.17,6.81 194.16,6.81 193.55,7.42 179.53,7.42 178.71,8.23 172.42,8.23 v172.01,7.82 170.79,6.6 164.69,6.6 164.29,7.01 162.86,7.01 162.46,7.42 155.75,7.42 154.74,6.4 152.91,6.4 151.89,7.42 150.47,7.42 149.66,8.23 143.56,8.23 v143.15,7.82 142.75,8.23 141.12,8.23 140.31,7.42 126.29,7.42 125.88,7.82 119.58,7.82 119.18,8.23 116.54,8.23 116.13,8.64 114.1,8.64 v114.1,8.23 113.69,7.82 103.53,7.82 103.33,7.62 101.9,7.62 101.7,7.82 99.06,7.82 98.86,7.62 96.82,7.62 96.22,8.23 94.39,8.23 94.18,8.03 91.54,8.03 90.93,8.64 87.07,8.64 86.66,9.04 83.41,9.04 v83.01,8.64 82.6,8.23 74.27,8.23 74.07,8.03 70.82,8.03 70.61,8.23 68.38,8.23 67.56,9.04 66.34,9.04 65.53,8.23 61.87,8.23 61.47,8.64 56.59,8.64 56.18,9.04 52.73,9.04 v52.32,8.64 | v13.31,12.9 14.53,14.12 v15.75,14.12 | v195.58,22.96 195.58,20.52 195.99,20.12 195.99,16.46 v195.07,15.54 | v201.68,26.52 201.78,26.42 207.16,26.42 207.98,27.23 207.97,27.43 RN4.P$2
  Bottom 0.203: D2.BOT2 227.08,14.35 225.86,13.11 225.86,11.18 224.74,10.06 v222.2,10.06 | v203.1,7.82 200.86,10.06 198.83,10.06 198.22,10.67 198.22,11.89 197.03,13.08 D6.BOT2 195.78,15.62 v195.07,15.54 | v172.01,7.82 169.16,10.67 168.15,10.67 167.74,11.07 167.74,12.9 166.95,13.69 D10.BOT2 | v143.15,7.82 143.15,8.84 141.12,10.87 139.5,10.87 136.88,13.49 D14.BOT2 | v114.1,8.23 112.06,10.26 109.83,10.26 109.42,10.67 108.61,10.67 108.41,10.87 108.41,12.5 107.62,13.28 D18.BOT2 | v83.01,8.64 81.38,10.26 79.96,10.26 78.74,11.48 78.74,12.5 77.75,13.49 D22.BOT2 | D26.BOT2 47.68,13.28 48.46,12.5 48.46,11.07 48.87,10.67 50.29,10.67 v52.32,8.64 51.71,8.03 33.22,8.03 33.02,7.82 29.57,7.82 25.91,11.48 14.53,11.48 v13.31,12.9 | v15.75,14.12 16,14.38 D30.BOT2 | 195.78,22.96 v195.58,22.96 199.95,22.96 201.88,24.89 201.88,26.21 201.68,26.42 v201.68,26.52
G2_TOP  (via drill 0.41)
  Top 0.203: D2.TOP2 229.57,15.14 v230.84,15.14 | v229.92,11.89 229.51,12.29 208.99,12.29 208.58,11.89 207.77,11.89 207.37,12.29 200.05,12.29 v199.64,11.89 199.24,12.29 169.16,12.29 v168.76,11.89 168.35,12.29 142.54,12.29 v142.14,12.7 141.73,12.29 119.58,12.29 119.18,11.89 118.36,11.89 117.96,12.29 109.83,12.29 v109.42,11.89 109.02,12.29 89.92,12.29 89.51,11.89 88.7,11.89 88.29,12.29 80.16,12.29 v79.76,11.89 79.35,12.29 61.47,12.29 61.06,11.89 58.22,11.89 57.81,12.29 49.89,12.29 v49.48,11.89 49.07,12.29 38.91,12.29 38.1,13.11 36.47,13.11 35.66,12.29 28.14,12.29 27.74,12.7 24.49,12.7 22.81,14.38 D30.TOP2 | v200.05,13.92 199.59,14.38 D6.TOP2 198.73,15.54 198.63,15.65 196.39,15.65 195.48,14.73 194.46,14.73 194.26,14.94 194.26,15.75 195.07,16.56 195.07,20.52 194.26,21.34 194.26,22.86 v194.36,22.96 | v170.18,13.92 169.72,14.38 D10.TOP2 | v140.51,14.53 140.36,14.38 D14.TOP2 | v110.85,13.92 110.39,14.38 D18.TOP2 | v80.77,13.92 80.31,14.38 D22.TOP2 | v50.7,13.92 50.24,14.38 D26.TOP2 | v200.86,25.81 200.96,25.7 204.11,25.7 205.03,24.79 206.6,24.79 207.31,24.08 209.7,24.08 210.41,24.79 210.41,25.3 210.74,25.63 212.01,25.63 212.1,25.55
  Top 0.305: 212.1,25.55 RN3.P$2
  Bottom 0.203: v230.84,15.14 230.43,15.14 229.92,14.63 v229.92,11.89 | v199.64,11.89 200.05,12.29 v200.05,13.92 | v168.76,11.89 170.18,13.31 v170.18,13.92 | v142.14,12.7 140.51,14.33 v140.51,14.53 | v109.42,11.89 110.85,13.31 v110.85,13.92 | v79.76,11.89 80.77,12.9 v80.77,13.92 | v49.48,11.89 50.7,13.11 v50.7,13.92 | v200.86,25.81 199.54,24.49 195.78,24.49 195.48,24.18 v194.36,22.96
G3_BOT  (via drill 0.41)
  Top 0.203: v219.56,10.67 218.74,9.86 216.51,9.86 215.9,9.25 214.68,9.25 213.66,8.23 209.4,8.23 208.99,8.64 206.15,8.64 205.74,9.04 202.29,9.04 201.47,8.23 195.58,8.23 194.77,9.04 193.95,9.04 v193.55,8.64 193.14,8.64 192.74,8.23 179.93,8.23 179.12,9.04 171.4,9.04 170.59,8.23 165.1,8.23 164.9,8.43 v164.08,8.43 163.88,8.23 155.35,8.23 154.33,7.21 153.31,7.21 152.3,8.23 150.88,8.23 150.06,9.04 139.29,9.04 138.48,8.23 135.23,8.23 134.82,8.64 v134.21,8.64 133.81,8.23 126.7,8.23 126.29,8.64 119.99,8.64 119.58,9.04 116.94,9.04 116.54,9.45 111.86,9.45 111.05,8.64 104.34,8.64 103.94,9.04 v102.51,9.04 102.11,8.64 98.65,8.64 98.45,8.43 97.23,8.43 96.62,9.04 93.98,9.04 93.78,8.84 91.95,8.84 91.34,9.45 87.48,9.45 87.07,9.86 82.19,9.86 81.38,9.04 74.88,9.04 74.07,9.86 71.83,9.86 v71.83,9.45 71.42,9.04 68.99,9.04 68.17,9.86 65.94,9.86 65.13,9.04 62.28,9.04 61.87,9.45 57,9.45 56.59,9.86 51.71,9.86 50.9,9.04 45.21,9.04 44.4,9.86 41.76,9.86 v41.76,9.45 | v199.85,26.31 200.25,26.72 200.25,26.82 200.76,27.33 205.13,27.33 205.59,26.87 206.81,26.87 207.17,27.24 RN4.P$3 | v186.64,22.05 187.15,22.05 187.66,21.54 187.66,15.95 v187.35,15.65
  Bottom 0.203: D3.BOT2 219.56,14.35 v219.56,10.67 | v193.55,8.64 191.92,10.26 190.7,10.26 190.3,10.67 190.3,12.29 189.51,13.08 D7.BOT2 188.24,15.65 v187.35,15.65 | v164.08,8.43 162.66,9.86 161.04,9.86 160.22,10.67 160.22,12.09 159.44,12.88 D11.BOT2 | v134.21,8.64 133.81,9.04 131.17,9.04 130.35,9.86 130.35,12.09 129.57,12.88 D15.BOT2 | v102.51,9.04 101.5,10.06 101.5,11.28 100.3,12.47 D19.BOT2 | v71.83,9.45 71.63,9.65 71.63,11.28 70.23,12.67 D23.BOT2 | D27.BOT2 40.16,12.67 41.35,11.48 41.35,9.86 v41.76,9.45 41.15,8.84 32.82,8.84 32.61,8.64 29.97,8.64 26.31,12.29 16.15,12.29 12.7,15.75 11.07,15.75 10.08,14.76 D31.BOT2 | v199.85,26.31 198.42,24.89 195.38,24.89 194.46,23.98 187.96,23.98 186.64,22.66 v186.64,22.05
G3_TOP  (via drill 0.41)
  Top 0.203: v223.22,13.92 221.74,13.92 D3.TOP2 221.18,14.48 221.18,15.34 220.98,15.54 217.12,15.54 v216.71,15.95 | v222.81,11.07 222.4,11.48 209.4,11.48 208.99,11.07 207.37,11.07 206.96,11.48 201.07,11.48 200.25,10.67 196.8,10.67 195.99,11.48 191.72,11.48 v191.31,11.07 190.91,11.48 170.18,11.48 169.37,10.67 166.32,10.67 165.51,11.48 161.65,11.48 v161.24,11.07 160.83,11.48 138.07,11.48 137.26,10.67 136.45,10.67 135.64,11.48 132.18,11.48 v131.78,11.07 131.37,11.48 119.99,11.48 119.58,11.07 117.96,11.07 117.55,11.48 110.85,11.48 110.03,10.67 106.98,10.67 106.58,11.07 v105.77,11.07 105.36,11.48 90.32,11.48 89.92,11.07 88.29,11.07 87.88,11.48 81.38,11.48 80.57,10.67 77.11,10.67 76.71,11.07 v75.9,11.07 75.49,11.48 61.87,11.48 61.47,11.07 57.81,11.07 57.4,11.48 50.9,11.48 50.09,10.67 47.04,10.67 46.23,11.48 v46.23,11.07 45.82,11.48 38.51,11.48 37.69,12.29 36.88,12.29 36.07,11.48 27.74,11.48 27.33,11.89 12.29,11.89 11.79,12.4 D31.TOP2 11.79,14.02 | v192.94,14.12 192.68,14.38 D7.TOP2 | v162.86,14.12 162.61,14.38 D11.TOP2 | v133.2,13.92 132.74,14.38 D15.TOP2 | v103.94,13.92 103.48,14.38 D19.TOP2 | v73.86,13.92 73.41,14.38 D23.TOP2 | v43.99,14.12 43.74,14.38 D27.TOP2 | RN3.P$3 212.85,24.99 212.85,24.75
  Top 0.305: 212.85,24.75 213.42,24.18 215.29,24.18 v215.39,24.08
  Bottom 0.203: v223.22,13.92 223.22,11.48 v222.81,11.07 | v191.31,11.07 192.94,12.7 v192.94,14.12 | v161.24,11.07 162.86,12.7 v162.86,14.12 | v131.78,11.07 133.2,12.5 v133.2,13.92 | v105.77,11.07 103.94,12.9 v103.94,13.92 | v75.9,11.07 73.86,13.11 v73.86,13.92 | v46.23,11.07 43.99,13.31 v43.99,14.12 | v215.39,24.08 215.39,22.15 216.2,21.34 216.2,20.52 216.41,20.32 216.41,16.26 v216.71,15.95
G4_BOT  (via drill 0.41)
  Top 0.203: v212.04,9.86 211.23,9.04 209.8,9.04 209.4,9.45 206.55,9.45 206.15,9.86 201.88,9.86 201.07,9.04 195.99,9.04 195.17,9.86 193.14,9.86 192.33,9.04 188.47,9.04 187.66,9.86 185.22,9.86 184.4,9.04 181.76,9.04 180.95,9.86 | 180.95,9.86 180.75,9.65 v180.75,9.45 | 180.95,9.86 170.99,9.86 170.18,9.04 165.51,9.04 164.69,9.86 163.07,9.86 162.26,9.04 158.39,9.04 157.58,9.86 155.14,9.86 | 155.14,9.86 v155.35,9.45 | 155.14,9.86 154.33,9.04 151.28,9.04 150.47,9.86 138.89,9.86 138.07,9.04 135.64,9.04 134.82,9.86 133.6,9.86 132.79,9.04 127.91,9.04 v127.51,9.45 | v88.7,17.78 89.71,18.8 91.14,18.8 91.54,18.39 91.54,16.36 91.95,15.95 95.2,15.95 96.01,15.14 97.43,15.14 98.25,15.95 102.72,15.95 103.53,15.14 104.34,15.14 104.95,15.75 111.25,15.75 111.46,15.95 117.75,15.95 118.16,16.36 v119.99,16.36 | v189.69,30.38 188.87,29.57 187.15,29.57 186.23,28.65 186.23,28.14 184.3,26.21 v184.3,25.7 | v178.41,22.45 177.39,21.44 174.75,21.44 172.92,19.61 172.92,16.87 173.43,16.36 177.09,16.36 177.29,16.56 177.29,17.37 178.1,18.19 178.92,18.19 179.53,17.58 179.53,16.46 v179.93,16.05 | RN4.P$4 206.37,27.62
  Top 0.356: v204.42,28.55 204.93,28.04 205.94,28.04 206.37,27.62
  Bottom 0.203: D28.BOT2 32.61,14.94 30.99,16.56 30.99,17.78 30.78,17.98 28.55,17.98 27.94,17.37 27.94,16.36 27.53,15.95 23.06,15.95 22.86,15.75 21.64,15.75 21.44,15.95 16.76,15.95 16.15,15.34 14.12,15.34 13.31,16.15 10.26,16.15 9.86,15.75 8.84,15.75 | 8.84,15.75 3.35,15.75 2.57,14.96 D32.BOT2 | D4.BOT2 212.04,14.35 v212.04,9.86 | v180.75,9.45 179.53,10.67 179.53,13.31 178.92,13.92 178.92,14.73 179.53,15.34 179.83,15.34 | 179.83,15.34 181.15,15.34 181.99,14.5 D8.BOT2 | v155.35,9.45 156.57,10.67 156.57,14.73 155.75,15.54 154.74,15.54 154.33,15.95 152.91,15.95 151.92,14.96 D12.BOT2 | v127.51,9.45 125.07,9.45 124.87,9.65 124.87,10.87 122.25,13.49 D16.BOT2 121.97,14.38 v119.99,16.36 | D24.BOT2 63.5,13.59 63.5,10.67 63.7,10.46 63.7,8.03 62.89,7.21 | 62.89,7.21 55.98,7.21 55.78,7.01 54.36,7.01 54.15,7.21 33.63,7.21 33.43,7.01 29.16,7.01 28.14,8.03 25.3,8.03 25.1,8.23 25.1,10.87 24.89,11.07 10.67,11.07 8.84,12.9 8.84,15.75 | 62.89,7.21 63.09,7.01 65.74,7.01 66.55,6.2 67.36,6.2 68.58,7.42 85.45,7.42 86.06,8.03 86.06,9.86 82.4,13.51 82.4,15.95 82.8,16.36 84.02,16.36 84.23,16.15 87.88,16.15 88.7,16.97 | 88.7,16.97 90.12,16.97 92.58,14.5 D20.BOT2 | v88.7,17.78 88.7,16.97 | v204.42,28.55 205.74,30.48 205.23,30.99 203.61,30.99 203.3,31.29 195.07,31.29 193.55,29.77 190.3,29.77 v189.69,30.38 | v184.3,25.7 184.3,24.69 182.88,23.27 179.12,23.27 v178.41,22.45 | v179.93,16.05 179.93,15.44 179.83,15.34
G4_TOP  (via drill 0.41)
  Top 0.203: D4.TOP2 214.02,14.12 v215.29,14.12 216.61,14.12 216.71,14.22 v216.71,14.83 | v215.49,10.26 215.09,10.67 209.8,10.67 209.4,10.26 206.96,10.26 206.55,10.67 201.47,10.67 200.66,9.86 196.39,9.86 195.58,10.67 192.74,10.67 191.92,9.86 188.87,9.86 188.06,10.67 184.2,10.67 v183.79,10.26 183.39,10.67 170.59,10.67 169.77,9.86 165.91,9.86 165.1,10.67 162.66,10.67 161.85,9.86 158.8,9.86 157.99,10.67 154.13,10.67 v153.72,10.26 153.31,10.67 138.48,10.67 137.67,9.86 136.04,9.86 135.23,10.67 133.2,10.67 132.38,9.86 128.93,9.86 128.12,10.67 126.29,10.67 v125.88,10.26 125.48,10.67 120.4,10.67 119.99,10.26 117.55,10.26 117.14,10.67 111.25,10.67 110.44,9.86 104.95,9.86 104.14,10.67 101.7,10.67 100.89,9.86 99.67,9.86 98.86,10.67 95.61,10.67 v95.2,10.26 94.79,10.67 90.73,10.67 90.32,10.26 87.88,10.26 87.48,10.67 81.79,10.67 80.98,9.86 75.29,9.86 74.47,10.67 71.22,10.67 70.41,9.86 69.39,9.86 68.58,10.67 64.92,10.67 v64.52,10.26 64.11,10.67 62.28,10.67 61.87,10.26 57.4,10.26 57,10.67 51.31,10.67 50.5,9.86 45.62,9.86 44.81,10.67 41.15,10.67 40.34,9.86 39.32,9.86 38.51,10.67 38.1,10.67 37.29,11.48 36.47,10.67 34.85,10.67 v34.44,10.26 34.04,10.67 27.33,10.67 26.92,11.07 10.67,11.07 7.37,14.38 D32.TOP2 | v185.83,14.12 185.57,14.38 D8.TOP2 | v155.55,14.12 155.3,14.38 D12.TOP2 | v126.09,13.92 125.63,14.38 D16.TOP2 | v96.42,14.12 96.16,14.38 D20.TOP2 | v66.34,13.92 65.89,14.38 D24.TOP2 | v36.27,14.73 36.02,14.38 D28.TOP2 | 213.71,24.99 RN3.P$4 | 215.8,24.99 216.31,24.49 v216.31,22.76
  Top 0.305: 215.8,24.99 213.71,24.99
  Bottom 0.203: v215.29,14.12 215.49,13.92 v215.49,10.26 | v183.79,10.26 185.83,12.29 v185.83,14.12 | v153.72,10.26 155.55,12.09 v155.55,14.12 | v125.88,10.26 126.09,10.46 v126.09,13.92 | v95.2,10.26 96.42,11.48 v96.42,14.12 | v64.52,10.26 66.34,12.09 v66.34,13.92 | v34.44,10.26 36.27,12.09 v36.27,14.73 | v216.31,22.76 216.31,21.95 216.61,21.64 216.61,20.83 216.92,20.52 216.92,16.97 217.83,16.05 217.83,15.44 217.32,15.44 v216.71,14.83
GND  (via drill 0.41, 0.51, 0.8, 0.86, 1.1)
  Top 0.203: IC1.2 201.98,44.82 | 183.52,44.6 M1.21 184.06,44.81
  Top 0.356: IC2.30 218.34,37.01
  Top 0.406: IC2.18 221.59,31.51 221.59,32.11 220.98,32.72 219.15,32.72 218.14,33.73 216.81,33.73 215.49,32.38 v215.49,32.41 214.68,31.6 214.68,31.29 215.49,30.48 215.49,29.67 214.81,28.98 IC2.8 | 218.34,37.01 v218.34,36.78 | IC3.4 221.13,54.34 224.03,54.36 226.26,54.36 226.67,53.95 X2.2 | IC5.8 206.97,35.45 206.15,36.27 202.29,36.27 201.98,36.58 201.98,37.9 201.17,38.71
  Top 0.508: 46.63,25.6 IC4.3 | C3.1 213.11,39.99 IC2.38 215.2,37.9 v216.1,37.9 | R2.2 200.52,43.45 200.66,43.59 201.68,43.59 201.98,43.89 IC1.2 | IC2.30 220.78,39.42 223.22,41.86 223.72,41.86 224.64,42.06 v225.15,42.57 | 235.81,38.74 235.84,38.71 X1.1
  Top 0.559: 46.63,26.14 48.33,27.84 148.95,27.84 v151.89,30.78
  Top 0.61: IC2.18 223.16,29.94 BAT1.MINUS2 | 46.63,26.14 46.63,25.6
  Top 0.762: 235.84,38.71 231.75,38.71 v227.89,42.57 227.89,46.08 C4.1 | v199.64,40.23 198.53,39.12 C12.- | 181.39,34.17 M1.14 | 181.39,34.17 181.15,33.93 181.15,31.94 M1.13 | 181.39,34.17 180.14,35.42 v180.14,36.58 180.85,37.29 180.85,44.2 181.46,44.81 181.56,44.81
  Top 1.016: 213,41.95 213,41 C3.1 | 213,41.95 C11.- | M1.22 181.13,45.24 181.56,44.81 181.76,44.6 183.52,44.6 | C2.- 188.57,39.32 191.01,41.76 191.01,47.96 185.22,47.96 185.22,47.82 185.18,44.67 M1.21 | C1.- 205.69,46.63 207.16,46.63 207.98,45.82 207.98,42.37 | R2.2 199.64,41.54 v199.64,40.23 201.17,38.71 207.16,38.71 207.26,38.81 | 207.98,42.37 207.98,40.34 207.26,39.62 207.26,38.81 | 207.26,38.81 207.26,38.35 C6.1 | 213,41.95 207.99,41.95 207.98,42.37 | v234.19,42.88 235.81,41.25 235.81,38.74
  Top 1.143: 185.22,47.82 183.83,47.82 v183.79,47.85 | C1.- 205.54,47.96 v206.35,48.77
  Bottom 0.406: 216.51,36.78 216.41,36.68 216.41,33.32 v215.49,32.41 | v218.34,36.78 216.51,36.78 | 216.51,36.78 216.51,37.49 v216.1,37.9
  Bottom 0.508: v151.89,30.78 161.65,30.78 163.27,32.41 175.97,32.41 v180.14,36.58 | v225.15,42.57 v227.89,42.57 | v234.19,42.88 234.19,44.2 226.67,51.66 X2.2
  Bottom 0.762: BAT1.MINUS2 BAT1.MINUS1
  Bottom 1.143: v183.79,47.85 195.07,47.85 198.42,51.21 204.93,51.21 206.35,49.78 v206.35,48.77
  pour Bottom (isolate 0.356, no thermals): 161.24,56.59 207.98,56.59 208.38,56.18 246.58,56.18 252.68,50.09 252.68,14.73 246.58,20.83 205.94,20.83 207.98,22.86 207.98,30.18 198.22,30.18 198.22,26.11 197,24.89 131.57,24.89 131.98,32.61 161.24,32.61
HALL_INTERRUPT  (via drill 0.41)
  Top 0.203: IC2.42 211.98,36.53
  Top 0.356: IC4.2 v51.4,26.55 54.34,26.55 R4.1 | v214.17,35.97 212.61,35.97 IC2.42
  Bottom 0.356: v51.4,26.55 51.4,26.82 52.93,28.35 145.8,28.35 149.45,32 153.11,32 153.52,31.6 161.44,31.6 163.27,33.43 173.84,33.43 186.84,46.63 197.21,46.63 202.69,41.15 204.52,41.15 207.87,37.8 212.34,37.8 v214.17,35.97
L1_B1  (via drill 0.41, 0.6)
  Top 0.178: 219.37,24.87 220.37,23.88 224.47,23.88
  Top 0.203: RN6.P$8 219.37,24.87 | v230.02,32.21 230.02,32.72 233.38,36.07 233.38,37.39 231.75,37.39 v231.24,36.88 | v225.15,41.25 224.84,41.25 IC2.28 | v236.83,29.36 237.03,29.16 237.03,26.72 237.24,26.52 237.85,25.91 237.85,23.47 237.44,23.06 234.19,23.06 232.97,24.28 232.97,24.69 232.56,25.1 v232.56,26.11
  Top 0.356: 224.47,23.88 RN5.P$8 | RN6.P$8 219.24,25.49 v218.34,25.5
  Bottom 0.203: v218.34,25.5 218.54,25.3 222,25.3 222.2,25.5 231.95,25.5 v232.56,26.11 | v230.02,32.21 231.04,31.19 233.17,31.19 235,29.36 v236.83,29.36 | v225.15,41.25 227.58,41.25 228.4,40.44 228.4,37.49 229.21,36.68 231.04,36.68 v231.24,36.88
L1_B2  (via drill 0.41)
  Top 0.178: 220.17,24.68 220.57,24.28 223.82,24.28
  Top 0.203: RN6.P$7 220.17,24.68 | 223.82,24.28 225.25,25.7 226.06,25.7 226.16,25.6 | 226.16,24.91 RN5.P$7 | v220.88,33.63 219.05,33.63 v217.93,34.75 | v220.98,36.37 220.98,36.88 220.37,37.49 220.37,37.91 IC2.29
  Top 0.305: 226.16,25.6 226.16,24.91 | RN6.P$7 220.17,25.61 v220.17,26.26
  Bottom 0.203: v220.17,26.26 220.17,28.85 222.61,31.29 222.61,32.21 221.08,33.63 v220.88,33.63 | v217.93,34.75 218.85,35.66 220.57,35.66 220.98,36.07 v220.98,36.37
L1_B3  (via drill 0.41)
  Top 0.178: 220.98,24.69 223.62,24.69
  Top 0.203: RN6.P$6 220.97,24.8 220.98,24.79 220.98,24.69 | 223.62,24.69 225.04,26.11 226.36,26.11 226.97,25.5 | 226.97,24.9 RN5.P$6 | v220.93,27.13 221.18,26.87 221.18,26.06 | v219.96,36.37 220.78,35.56 222.2,35.56 222.91,34.85 v222.91,33.43 | v218.14,39.12 218.18,39.12 IC2.32
  Top 0.305: 226.97,25.5 226.97,24.9 | RN6.P$6 220.97,25.85 221.18,26.06
  Bottom 0.203: v220.93,27.13 220.93,28.96 223.52,31.6 223.52,32.82 v222.91,33.43 | v219.96,36.37 219.96,37.29 v218.14,39.12
L1_B4  (via drill 0.41)
  Top 0.203: 221.89,25.35 RN6.P$5 | 223.57,25.35 224.84,26.52 225.15,26.52 | 225.15,26.52 226.62,26.52 227.79,25.35 | 227.79,24.89 RN5.P$5 | 225.15,26.52 225.15,28.55 v224.13,29.57 | IC2.33 217.02,39.08 v217.02,38.81
  Top 0.305: 223.57,25.35 221.89,25.35 | 227.79,25.35 227.79,24.89
  Bottom 0.203: v224.13,29.57 224.13,30.99 224.33,31.19 227.79,31.19 229.72,33.12 229.72,34.95 229.41,35.26 227.99,35.26 225.35,37.9 223.32,37.9 219.56,41.55 219.46,41.55 217.02,39.12 v217.02,38.81
L1_G1  (via drill 0.41)
  Top 0.203: v211.12,30.58 210.82,30.58 209.6,29.36 209.6,26.35 | 209.6,26.35 RN4.P$8 | 209.6,26.35 210.27,27.01 | v216.81,32.51 216.81,28.65 215.99,27.82 IC2.10
  Top 0.305: 210.27,27.01 RN3.P$8
  Bottom 0.203: v211.12,30.58 216.51,30.58 216.81,30.89 v216.81,32.51
L1_G2  (via drill 0.41)
  Top 0.178: 211.94,26.42 210.31,26.42
  Top 0.203: RN4.P$7 | 207.98,24.99 208.08,24.89 209.3,24.89 209.6,25.2 209.6,25.7 210.31,26.42 | 211.94,26.42 212.1,26.57 RN3.P$7 212.04,27.07 | 212.04,27.74 211.84,27.94 v210.41,27.94 | v217.83,32.82 217.53,32.51 217.53,32.11 217.22,31.8 217.22,27.99 216.51,27.28 IC2.11
  Top 0.305: 207.98,24.99 RN4.P$7 | 212.04,27.74 212.04,27.07
  Bottom 0.203: v210.41,27.94 211.63,27.94 213.56,30.07 217.22,30.07 217.22,31.8 217.53,32.11 217.53,32.51 v217.83,32.82
L1_G3  (via drill 0.41)
  Top 0.203: RN4.P$6 | 207.16,24.89 207.57,24.49 209.5,24.49 210.01,24.99 210.01,25.5 210.54,26.04 212.47,26.04 212.9,26.46 RN3.P$6 212.85,27.06 | 218.14,28.14 218.14,30.89 v218.34,31.09 | IC2.12 219.02,27.26
  Top 0.254: 207.16,24.89 RN4.P$6
  Top 0.305: v212.85,28.14 212.85,27.06
  Top 0.356: 219.02,27.26 218.14,28.14
  Bottom 0.203: v212.85,28.14 214.27,29.57 217.73,29.57 217.93,29.77 217.93,30.68 v218.34,31.09
L1_G4  (via drill 0.41)
  Top 0.203: 213.79,26.92 RN3.P$5 | 217.63,26.92 v217.63,27.03 217.63,31.6 218.14,32.11 218.64,32.11 218.85,31.9 218.95,31.6 219.05,31.39 219.05,30.28 218.54,29.77 218.54,28.96 219.62,27.88 IC2.13 | RN4.P$5 206.25,25.6 205.33,25.6 v205.23,25.7
  Top 0.305: v214.66,26.92 213.79,26.92
  Bottom 0.203: v217.63,27.03 214.76,27.03 v214.66,26.92 v214.65,26.92 214.56,27.01 206.54,27.01 v205.23,25.7
L1_R1  (via drill 0.41)